# Altium schematic sheet io-devices.SchDoc
size A4; SheetNumber: 5; SheetTotal: 7
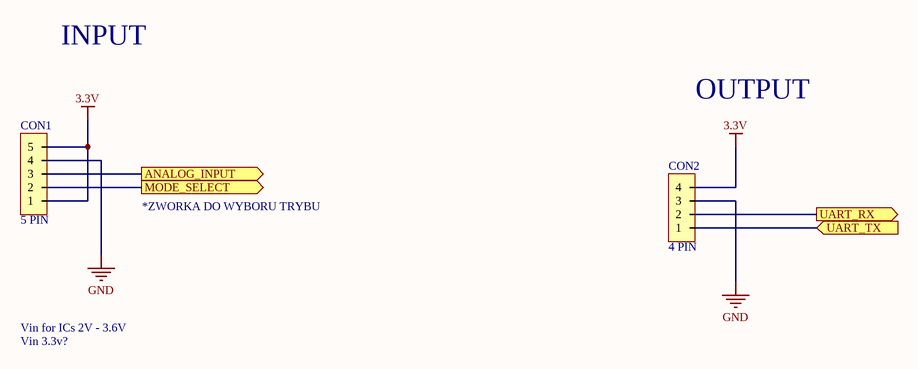
[diagram p0: io-devices.SchDoc]

## Parts
CON1  5 PIN  [Goldpin 2.54mm 5P]
CON2  4 PIN  [Goldpin 2.54MM 4P]

## Ports
ANALOG_INPUT (out), MODE_SELECT (out), UART_RX (out), UART_TX (in)

## Nets
3.3V: CON1.1 CON1.5 CON2.4
GND: CON1.4 CON2.3
ANALOG_INPUT: CON1.3 ; port ANALOG_INPUT
MODE_SELECT: CON1.2 ; port MODE_SELECT
UART_RX: CON2.2 ; port UART_RX
UART_TX: CON2.1 ; port UART_TX

## Notes on the sheet
- INPUT
- OUTPUT
- *ZWORKA DO WYBORU TRYBU
- Vin for ICs 2V - 3.6V
- Vin 3.3v?